# Altium project RF Board with STM32.PrjPcb
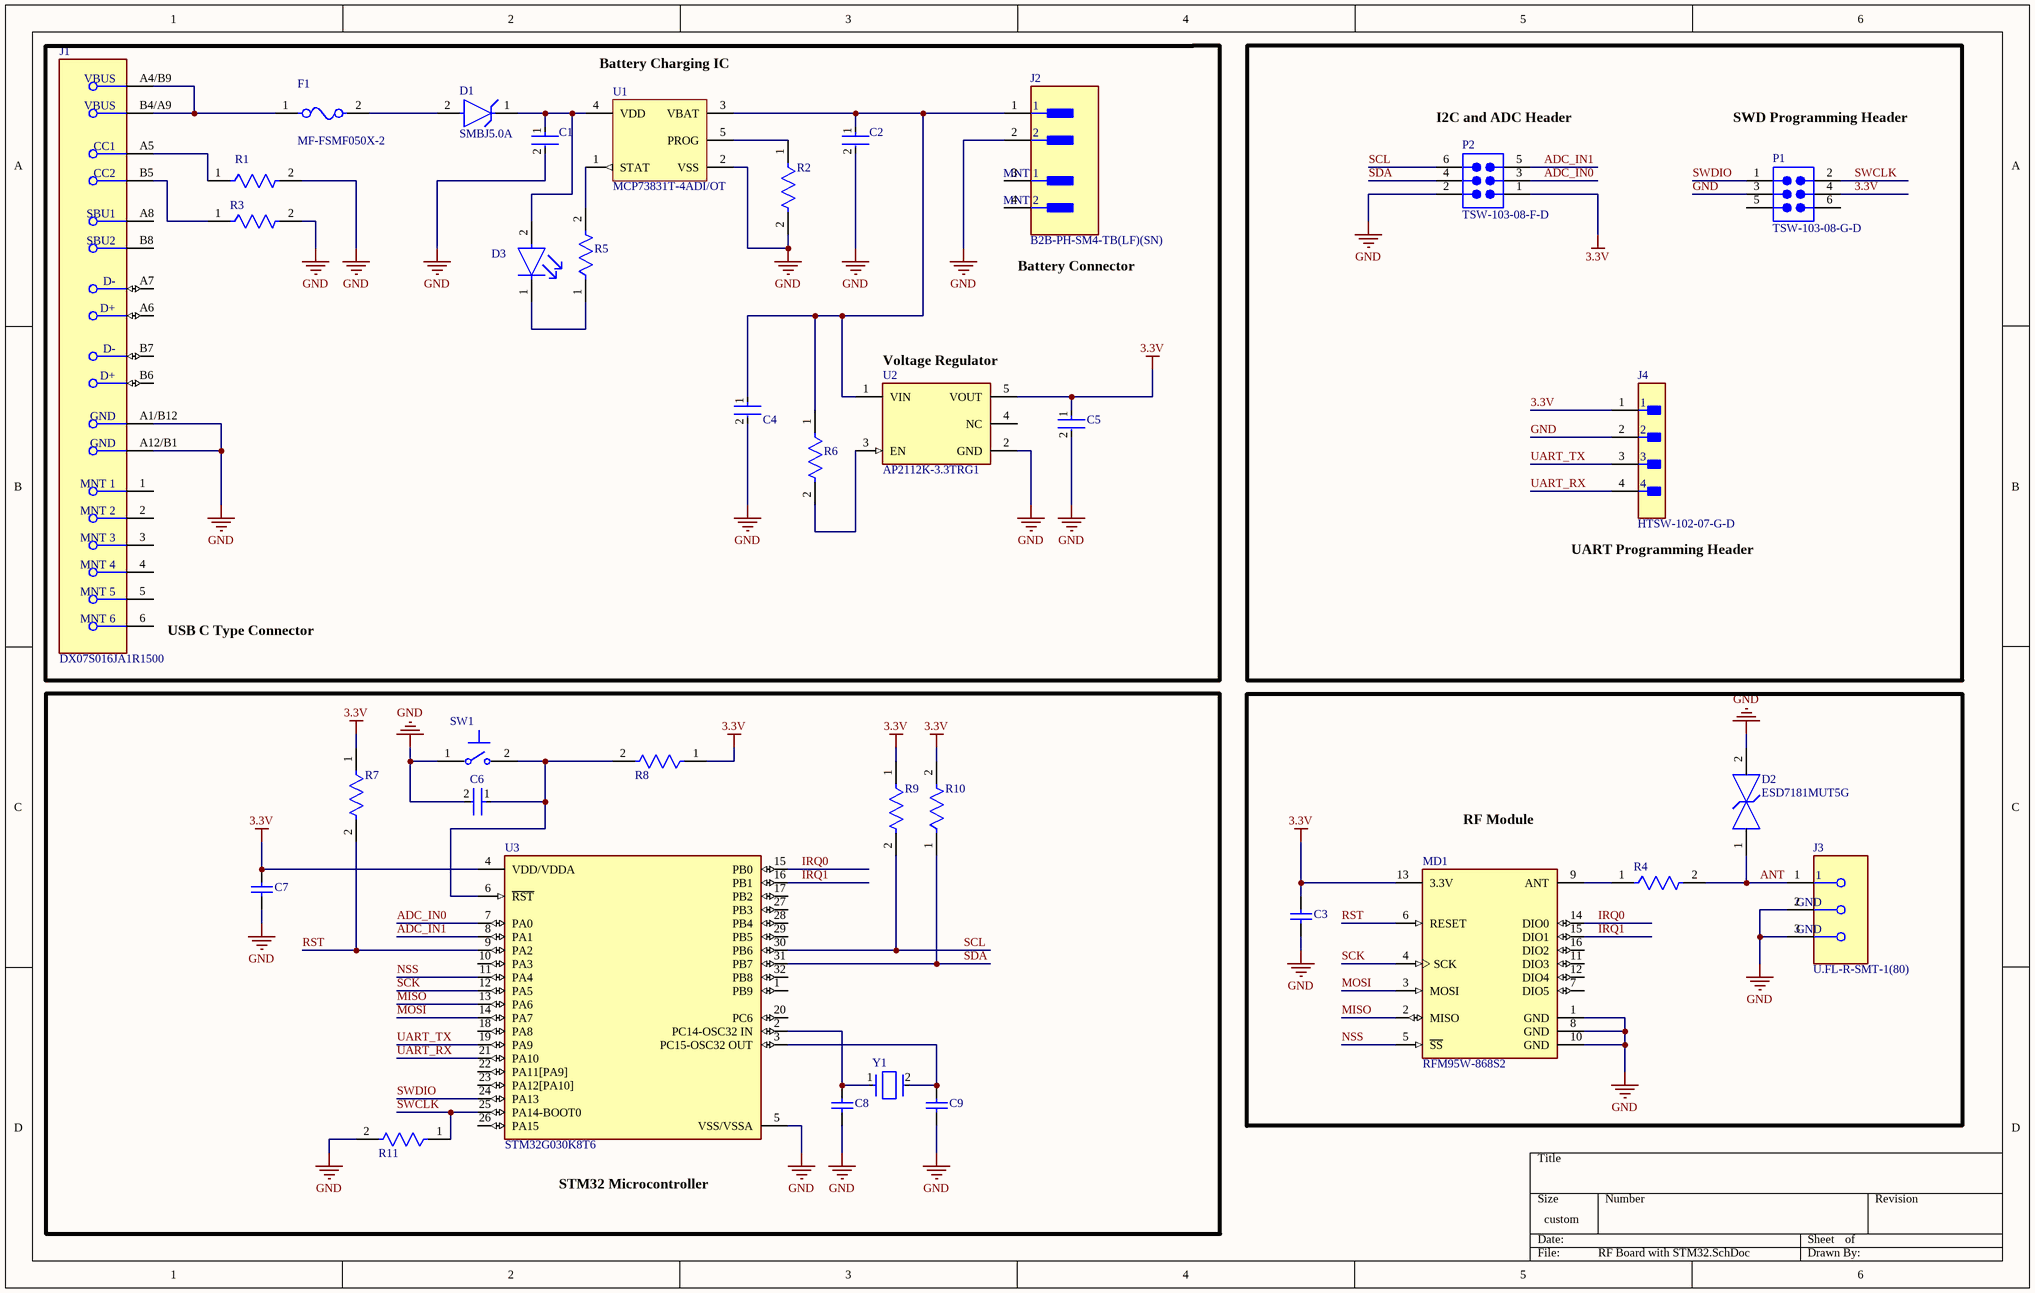
[diagram p0: RF Board with STM32.SchDoc]
1 sheet, 36 parts. Net scope: global (net labels, ports and power ports of the same name join across sheets).
Board file: RF Board with STM32..PcbDoc

## Sheet RF Board with STM32.SchDoc
size 381 x 241 mm; SheetNumber: 1; SheetTotal: 1

### Parts
C1  GRM188R61E475KE11J  [FP-GRM188-0_15-IPC_A]  (value not drawn)
C2  GRM188R61E475KE11J  [FP-GRM188-0_15-IPC_A]  (value not drawn)
C3  06031A100CAT2A  [CAPC1608X90X35ML15T15]  (value not drawn)
C4  GRM155C81A105KA12J  [FP-GRM155-0_05-IPC_A]  (value not drawn)
C5  GRM155C81A105KA12J  [FP-GRM155-0_05-IPC_A]  (value not drawn)
C6  GRM033R61A104KE15D  [FP-GRM033-0_03-IPC_C]  (value not drawn)
C7  06031A100CAT2A  [CAPC1608X90X35ML15T15]  (value not drawn)
C8  VJ0603Y104KXJAC  [CAPC1608X92X38NL15T08]  (value not drawn)
C9  VJ0603Y104KXJAC  [CAPC1608X92X38NL15T08]  (value not drawn)
D1  SMBJ5.0A  [FP-SMBJ-MFG]
D2  ESD7181MUT5G  [FP-152AF-MFG]
D3  LS R976-NR-1  [FP-LS_R976-MFG]  (value not drawn)
F1  MF-FSMF050X-2  [FP-MF-FSMF-MFG]
J1  DX07S016JA1R1500  [FP-DX07S016JA1R1500-MFG]
J2  B2B-PH-SM4-TB(LF)(SN)  [FP-B2B-PH-SM4-TB_LF_SN-MFG]
J3  U.FL-R-SMT-1(80)  [FP-U_FL-R-SMT-1_80-MFG]
J4  HTSW-102-07-G-D  [FP-HTSW-102-07-G-D-MFG]
MD1  RFM95W-868S2  [FP-RFM95W-868S2-MFG]
P1  TSW-103-08-G-D  [SMTC-TSW-103-08-X-D]
P2  TSW-103-08-F-D  [SMTC-TSW-103-08-X-D]
R1  AC0603FR-075K1L  [FP-AC0603-MFG]  (value not drawn)
R2  RP73PF1J2K0BTDF  [FP-RP73P-1J-MFG]  (value not drawn)
R3  AC0603FR-075K1L  [FP-AC0603-MFG]  (value not drawn)
R4  CRG0603ZR  [FP-CRG0603-IPC_C]  (value not drawn)
R5  RT0603BRD07470RL  [FP-RT0603-MFG]  (value not drawn)
R6  ERJ-U02F1003X  [FP-ERJU02-MFG]  (value not drawn)
R7  RT0603FRE1010KL  [FP-RT0603-MFG]  (value not drawn)
R8  RT0603FRE1010KL  [FP-RT0603-MFG]  (value not drawn)
R9  CRG0402F4K7  [FP-CRG0402-IPC_B]  (value not drawn)
R10  CRG0402F4K7  [FP-CRG0402-IPC_B]  (value not drawn)
R11  RT0603FRE1010KL  [FP-RT0603-MFG]  (value not drawn)
SW1  TL1015AF160QG  [FP-TL1015AF160QG-MFG]  (value not drawn)
U1  MCP73831T-4ADI/OT  [SOT-23-OT5_N]
U2  AP2112K-3.3TRG1  [FP-SOT25-IPC_A]
U3  STM32G030K8T6  [FP-LQFP32-5V-IPC_A]
Y1  ABS07-32.768KHZ-7-T  [FP-ABS07-MFG]  (value not drawn)

### Blocks framed on the sheet
STM32 Microcontroller: C6-C9 R7-R11 SW1 U3 Y1
RF Module: C3 D2 J3 MD1 R4

### Nets
3.3V: C3.2 C5.1 C7.2 J4.1 MD1.13(3.3V) P1.4 P2.1 R7.1 R8.1 R9.1 R10.2 U2.5(VOUT) U3.4(VDD/VDDA)
GND: C1.2 C2.2 C3.1 C4.2 C5.2 C6.2 C7.1 C8.1 C9.1 D2.2 J1.A1/B12(GND) J1.A12/B1(GND) J2.2 J3.2(GND) J3.3(GND) J4.2 MD1.1(GND) MD1.8(GND) MD1.10(GND) P1.3 P2.2 R1.2 R2.2 R3.2 R11.2 SW1.1 U1.2(VSS) U2.2(GND) U3.5(VSS/VSSA)
ADC_IN0: P2.3 U3.7(PA0)
ADC_IN1: P2.5 U3.8(PA1)
ANT: D2.1 J3.1 R4.2
IRQ0: MD1.14(DIO0) U3.15(PB0)
IRQ1: MD1.15(DIO1) U3.16(PB1)
MISO: MD1.2(MISO) U3.13(PA6)
MOSI: MD1.3(MOSI) U3.14(PA7)
NSS: MD1.5(~{SS}) U3.11(PA4)
RST: MD1.6(RESET) R7.2 U3.9(PA2)
SCK: MD1.4(SCK) U3.12(PA5)
SCL: P2.6 R9.2 U3.30(PB6)
SDA: P2.4 R10.1 U3.31(PB7)
SWCLK: P1.2 R11.1 U3.25(PA14-BOOT0)
SWDIO: P1.1 U3.24(PA13)
UART_RX: J4.4 U3.21(PA10)
UART_TX: J4.3 U3.19(PA9)
NetC1_1: C1.1 D1.1(C) D3.2(A) U1.4(VDD)
NetC2_1: C2.1 C4.1 J2.1 R6.1 U1.3(VBAT) U2.1(VIN)
NetC6_1: C6.1 R8.2 SW1.2 U3.6(~{RST})
NetC8_2: C8.2 U3.2(PC14-OSC32_IN) Y1.1
NetC9_2: C9.2 U3.3(PC15-OSC32_OUT) Y1.2
NetD1_2: D1.2(A) F1.2
NetD3_1: D3.1(C) R5.1
NetF1_1: F1.1 J1.A4/B9(VBUS) J1.B4/A9(VBUS)
NetJ1_A5: J1.A5(CC1) R1.1
NetJ1_B5: J1.B5(CC2) R3.1
NetMD1_9: MD1.9(ANT) R4.1
NetR2_1: R2.1 U1.5(PROG)
NetR5_2: R5.2 U1.1(STAT)
NetR6_2: R6.2 U2.3(EN)

Not connected (* = marked no-connect by the designer): J1 1(MNT_1) 2(MNT_2) 3(MNT_3) 4(MNT_4) 5(MNT_5) 6(MNT_6) A6(D+) A7(D-) A8(SBU1) B6(D+) B7(D-) B8(SBU2); J2 3(MNT_1) 4(MNT_2); MD1 7(DIO5) 11(DIO3) 12(DIO4) 16(DIO2); P1 5 6; U2 4(NC); U3 1(PB9) 10(PA3) 17(PB2) 18(PA8) 20(PC6) 22(PA11[PA9]) 23(PA12[PA10]) 26(PA15) 27(PB3) 28(PB4) 29(PB5) 32(PB8)

### Notes on the sheet
- (near U1) Battery Charging IC
- (near P2) I2C and ADC Header
- SWD Programming Header
- (near J2) Battery Connector
- (near U2) Voltage Regulator
- (near J4) UART Programming Header
- (near J1) USB C Type Connector

### Library data of the parts
C1 C2 = CMP-06035-051692-1: Chip Multilayer Ceramic Capacitors for General Purpose, 0603, 4.7uF, X5R, 15%, 10%, 25V; Max Operating Temperature: 85°C; Tolerance: 10%; Capacitance: 4.7uF; Weight: 0.000222oz; Voltage Rating (DC): 25V; Length: 0.063inch; Mount: Surface Mount; Packaging: Tape and Reel; Min Operating Temperature: -55°C; Package Quantity: 10000; Dielectric: X5R; Width: 0.031inch; Voltage Rating: 25V; Thickness: 0.037inch; Case/Package: 0603
C3 C7 = CMP-2006-03979-1: Manufacturer: AVX Interconnect / Elco; Part Number: 06031A100CAT2A
C4 C5 = CMP-06035-052171-1: Chip Multilayer Ceramic Capacitors for General Purpose, 0402, 1.0uF, X6S, 22%, 10%, 10V; Capacitance: 1uF; Voltage Rating: 10V; Case/Package: 0402; Voltage Rating (DC): 10V; Package Quantity: 50000; Width: 0.02inch; Length: 0.039inch; Weight: 0.000212oz; Dielectric: X6S; Tolerance: 10%; Mount: Surface Mount; Max Operating Temperature: 105°C; Thickness: 0.022inch; Packaging: Tape and Reel; Min Operating Temperature: -55°C
C6 = CMP-2010-01264-2: Chip Multilayer Ceramic Capacitors for General Purpose, 0201, 0.10uF, X5R, 15%, 10%, 10V; Capacitance: 100nF; Mount: Surface Mount; Dielectric: X5R; Width: 0.012inch; Tolerance: 10%; Radiation Hardening: No; Voltage Rating: 10V; REACH SVHC: No SVHC; Height: 0.3mm; Max Operating Temperature: 85°C; Voltage Rating (DC): 10V; Thickness: 0.013inch; Termination: SMD/SMT; Lead Free: Lead Free; Package Quantity: 1; Case/Package: 0201; Min Operating Temperature: -55°C; Weight: 6E-06oz; Length: 0.6mm; Case Code (Imperial): 0201; Depth: 0.3mm; Voltage: 10V; Packaging: Tape and Reel; Case Code (Metric): 0603
C8 C9 = CMP-2006-01976-1: Manufacturer: Vitramon; Part Number: VJ0603Y104KXJAC
D1 = CMP-07401-000003-1: TVS DIODE 5V 9.2V SMB; Manufacturer: Bourns Inc.; Number Of Channels: 1; Breakdown Voltage: 6.4V; Peak Pulse Power: 600W; Peak Pulse Current: 65.3A; Max Junction Temp: +150°C; Standoff Height: 0.05mm; Direction: Unidirectional; RoHS: TRUE; Device Class L3: unset; Height: 2.44mm; Package: SMBJ; Lead Free: Yes; Category: Diode; Device Class L1: Circuit Protection; Octopart: https://octopart.com/smbj5.0a-bourns-12809487; Reverse Standoff Voltage: 5V; Device Class L2: TVS Diodes; Temperature Range Low: -55°C; Automotive: No; Clamping Voltage: 9.2V; ComponentLink2URL: https://www.bourns.com/docs/Product-Datasheets/SMBJ.pdf; Manufacturer Part Number: SMBJ5.0A; ComponentLink2Description: Datasheet; Temperature Range High: +150°C; Digikey Description: TVS DIODE 5V 9.2V SMB; Temperature: -55°C to +150°C; Mouser Description: Dio Tvs Vwm 5.0V 600W Unidir Smb Rohs Compliant: Yes
D2 = CMP-00278-33922270-1: ESD7181MUT5G ESD Suppressor Diode TVS Bi-Dir 18.5V 2-Pin X3-DFN T/R / TVS DIODE 18.5VWM 35VC; Manufacturer Lifecycle Status: ACTIVE; Power Line Protection: No; Direction: Bidirectional; Peak Pulse Current: 1A; Capacitance: 600fF; Number of Bidirectional Channels: 1; Clamping Voltage: 35V; Element Configuration: Single; Min Breakdown Voltage: 20.5V; Packaging: Tape & Reel (TR); Lead Free: Lead Free; Reverse Standoff Voltage: 18.5V; Operating Supply Voltage: 18.5V; Number of Pins: 2; Case/Package: DFN; Working Voltage: 18.5V; Schedule B: 8536300000; Mount: Surface Mount; NexarPartId: 33922270; Lifecycle Status: Production; Max Operating Temperature: 150°C; Composition: Zener; Min Operating Temperature: -55°C; RoHS: Compliant; Contact Plating: Gold
D3 = CMP-62016-000037-1: LED RED DIFFUSED 0805 SMD; Lens Size: 1.25mm; Number of LEDs: 1; Luminous Intensity: 180mcd; Dominant Wavelength: 633nm; Lens Style: Flat; Reverse Voltage: 12V; Lens Color: White; Forward Voltage: 2.5V; Forward Current: 25mA; Power Dissipation: 65W; Luminous Flux: 0.47lm; Test Current: 20mA; Viewing Angle: 160°; Length: 2mm; Number of Pins: 2; Lens Transparency: Diffused; Min Operating Temperature: -30°C; Case Code (Metric): 2012; Depth: 1.35mm; Color: Red; Illumination Color: Red; Max Operating Temperature: 85°C; Mount: Surface Mount; Case/Package: 0805; Height: 0.9mm; Package Quantity: 16000; Number of Elements: 1; Radiation Hardening: No; Case Code (Imperial): 0805; Packaging: Tape and Reel; Width: 1.25mm
F1 = CMP-07400-000010-1: PTC RESET FUSE 6V 500MA 0603; Manufacturer: Bourns Inc.; Trip Current: 1A; Current Rating: 40A; Hold Current: 0.5A; Resistance: 0.1-0.8Ω; Value: 0.1-0.8Ω; Trip Time: 0.1s; Mouser Description: Resettable Fuses - PPTC 6volts 40amps; Category: Fuse; Digikey Description: PTC RESET FUSE 6V 500MA 0603; Temperature: -40°C to +85°C; Device Class L3: unset; Automotive: No; RoHS: TRUE; Ambient Temperature Range High: +85°C; Device Class L2: PTC Resettable Fuses; Temperature Range High: +85°C; Voltage Rating: 6V; Package: MF-FSMF; Manufacturer Part Number: MF-FSMF050X-2; Ambient Temperature Range Low: -40°C; Lead Free: Yes; ComponentLink2Description: Datasheet; Octopart: https://octopart.com/mf-fsmf050x-2-bourns-10470804; ComponentLink2URL: https://www.bourns.com/docs/Product-Datasheets/mffsmf.pdf; Temperature Range Low: -40°C; Height: 1mm; Device Class L1: Circuit Protection
J1 = CMP-19038-000003-1: CONN RCP USB2.0 TYP C 24P SMD RA
J2 = CMP-2000-05163-2: CONN HEADER SMD 2POS 2MM; Number of Poles: 2; Max Current Rating: 2A; Gender: Male; Working Voltage: 100V; Mated Stacking Heights: 8.6mm; Contact Resistance: 20mR; Insulation Resistance: 1GR; Number of Contacts: 2; Housing Material: Polyamide; Lead Pitch: 2mm; Packaging: Tape and Reel; Fastening Type: Detent; Contact Finish - Mating: TIN; Width: 5.5mm; Min Operating Temperature: -25°C; Mount: Surface Mount; Current Rating: 2A; Pitch: 2mm; REACH SVHC: No SVHC; Flammability Rating: UL94 V-0; Contact Plating: Tin; Voltage Rating (AC): 100V; Length: 7.95mm; Number of Rows: 1; Max Operating Temperature: 85°C; Connector Type: Header; Height: 9.4mm; Insulation Material: Nylon; Depth: 5mm; Color: White; Termination: Solder; Housing Color: Beige; Contact Mating Length: 0.13inch; Contact Material: Copper Alloy; Orientation: Straight; Contact Type: Male Pin; Lead Free: Lead Free; Voltage Rating: 100V; Series: PH; Number of Positions: 2; Contact Shape: Square; Max Voltage Rating (AC): 100V; Insulation Color: Natural
J3 = CMP-11598-000004-1: CONN U.FL RCPT STR 50 OHM SMD; Mating Cycles: 30; Impedance: 50R; Body Plating: Silver; Center Contact Plating: Gold; Body Material: Bronze; Dielectric Material: Polymer; Connector Type: Receptacle; Number of Ports: 1; Max Frequency: 6GHz; Mount: Surface Mount; Termination: Solder; Case/Package: SMD/SMT; Min Operating Temperature: -40°C; Series: U.FL; Max Operating Temperature: 90°C; Fastening Type: SNAP-ON; RoHS Compliant: Yes; Packaging: Tape and Reel; Package Quantity: 10000; Contact Material: Brass; Housing Color: Beige; Lead Free: Lead Free
J4 = CMP-02766-000010-1: CONN HEADER VERT 4POS 2.54MM; Manufacturer: Samtec; Voltage Rating: 550V; Conn Orientation: Straight; Number Of Contacts: 4; Conn Gender: Male; Current Rating: 6.3A; Number Of Rows: 2; Category: Conn; Temperature: -55°C to +125°C; Automotive: No; Digikey Description: CONN HEADER VERT 4POS 2.54MM; ComponentLink2URL: http://suddendocs.samtec.com/catalog_english/htsw_th.pdf; Device Class L2: Headers and Wire Housings; Mouser Description: Conn Unshrouded Header HDR 4 POS 2.54mm Solder ST Thru-Hole Bag; Manufacturer Part Number: HTSW-102-07-G-D; Temperature Range High: +125°C; Contact Material: Gold,Nickel; Temperature Range Low: -55°C; ComponentLink2Description: Datasheet; Device Class L1: Connectors; Pitch: 2.54mm; Octopart: https://octopart.com/htsw-102-07-g-d-samtec-10531767; RoHS: TRUE; Package: HTSW-102-07-G-D; Lead Free: Yes; Device Class L3: unset; Height: 8.71mm
MD1 = CMP-204316-000001-1: RX TXRX MODULE ISM < 1GHZ SMD; Data Rate: 300Kbps; Frequency: 868MHz; Sensitivity: -123dBm; Interface: SPI; Current - Transmitting: 120mA; Current - Receiving: 12.1mA; Max Operating Temperature: 70°C; Case/Package: SMD/SMT; Packaging: Bulk; Mount: Surface Mount; Min Operating Temperature: -20°C
P1 = CMP-1024-00338-1: 0.025" SQ Post Header, Through-hole, Vertical, -55 to 125 degC, 2.54 mm Pitch, 6-Pin, Male, RoHS; Manufacturer: Samtec; Pitch: 2.54 mm; ComponentLink1URL: http://www.samtec.com; ComponentLink2URL: http://www.samtec.com/documents/webfiles/pdf/TSW_TH.PDF; Temperature Range: -55 to 125 degC; RoHS: True; ComponentLink2Description: Datasheet; PackageReference: TSW-103-08-X-D; ComponentLink3Description: Package Specification; PackageDescription: .025[0.64] SQ. Post Terminal Strip Assembly; DatasheetVersion: F-214; Mounting Technology: Through-hole; ComponentLink1Description: Manufacturer URL; Orientation: Vertical; PartNumber: TSW-103-08-G-D; PackageVersion: DM, 8/1988; ComponentLink3URL: http://www.samtec.com/documents/webfiles/cpdf/TSW-XXX-XX-XXX-X-XX-XXX-MKT.pdf
P2 = CMP-1024-00337-1: 0.025" SQ Post Header, Through-hole, Vertical, -55 to 125 degC, 2.54 mm Pitch, 6-Pin, Male, RoHS; Manufacturer: Samtec; Pitch: 2.54 mm; ComponentLink1URL: http://www.samtec.com; PackageReference: TSW-103-08-X-D; ComponentLink3Description: Package Specification; PackageDescription: .025[0.64] SQ. Post Terminal Strip Assembly; PartNumber: TSW-103-08-F-D; DatasheetVersion: F-214; ComponentLink1Description: Manufacturer URL; ComponentLink2Description: Datasheet; ComponentLink2URL: http://www.samtec.com/documents/webfiles/pdf/TSW_TH.PDF; PackageVersion: DM, 8/1988; Orientation: Vertical; Mounting Technology: Through-hole; RoHS: True; Temperature Range: -55 to 125 degC; ComponentLink3URL: http://www.samtec.com/documents/webfiles/cpdf/TSW-XXX-XX-XXX-X-XX-XXX-MKT.pdf
R1 R3 = CMP-03412-025080-2: RES 5.1KΩ 1.00% 0.1W 0603; Voltage Rating: 50V; Temperature Coefficient: 100ppm/°C; Resistance: 5.1kR; Max Power Dissipation: 100mW; Tolerance: 1%; Max Operating Temperature: 155°C; Min Operating Temperature: -55°C; Ratings: AEC-Q200; Features: Moisture Resistant; RoHS Compliant: Yes; Number of Terminations: 2; Weight: 7.1E-05oz; Case Code (Imperial): 0603; Resistor Type: Thick Film; Length: 1.6mm; Termination: SMD/SMT; Case Code (Metric): 1608; Packaging: Tape and Reel; Width: 0.8mm; Series: AC; Case/Package: 0603; Power Rating: 100mW; Height: 0.45mm
R2 = CMP-03211-004349-1: RES SMD 2K OHM 0.1% 1/6W 0603; Manufacturer: TE Connectivity; Value: 2KΩ; Voltage Rating: 100V; Temperature Coefficient: 25ppm/°C; Tolerance: 0.001; Power Rating: 0.166W; Height: 0.55mm; Manufacturer Part Number: RP73PF1J2K0BTDF; Temperature: -55°C to +155°C; Category: Res; Temperature Range Low: -55°C; Ipc Land Pattern Name: RESC15580X45; Device Class L2: Resistors; Device Class L3: Chip SMD Resistors; Lead Free: Yes; ComponentLink2URL: https://www.te.com/commerce/DocumentDelivery/DDEController?Action=srchrtrv&DocNm=1773272&DocType=DS&DocLang=English; ComponentLink2Description: Datasheet; Composition: Thin Film; Device Class L1: Passive Components; Automotive: No; Temperature Range High: +155°C; RoHS: TRUE; Series: RP73P; Digikey Description: RES SMD 2K OHM 0.1% 1/6W 0603; Octopart: https://octopart.com/rp73pf1j2k0btdf-te+connectivity-23826916; Resistance: 2KΩ; Package: RP73P-1J
R4 = CMP-03211-011415-1: RES SMD 0 OHM JUMPER 1/10W 0603; Voltage Rating: 50V; Resistance: 0mR; Power Rating: 100mW; Number of Resistors: 1; Tolerance: 0%; Temperature Coefficient: 100ppm/°C; Packaging: Tape and Reel; Series: CRG, Neohm; Technology: THICK FILM; Depth: 0.8mm; Width: 0.8mm; Min Operating Temperature: -55°C; Number of Terminations: 2; Length: 1.6mm; Weight: 7.1E-05oz; Resistor Type: Thick Film; Height: 0.45mm; Max Operating Temperature: 125°C; Case/Package: 0603; ELV: Compliant; Package Quantity: 5000; Radiation Hardening: No; RoHS Compliant: Yes; Termination: Solder; Case Code (Metric): 1608; Mount: Surface Mount; Case Code (Imperial): 0603; Max Power Dissipation: 100mW
R5 = CMP-2000-04460-2: RES SMD 470 OHM 0.1% 1/10W 0603; Manufacturer: Yageo; Resistance: 470Ω; Voltage Rating: 75V; Tolerance: 0.001; Temperature Coefficient: 25 ppm/°C; Power Rating: 0.1W; Value: 470Ω; ComponentLink2Description: Datasheet; Temperature Range Low: -55°C; Mouser Description: Res Thin Film 0603 470 Ohm 0.1% 1/10W ±25ppm/°C Molded SMD SMD Paper T/R; Device Class L2: Resistors; Octopart: https://octopart.com/rt0603brd07470rl-yageo-1424253; RoHS: TRUE; Lead Free: Yes; Automotive: No; Temperature Range High: +155°C; Ipc Land Pattern Name: RESC16080X45; Package: RT0603; Category: Res; Device Class L3: Chip SMD Resistors; Manufacturer Part Number: RT0603BRD07470RL; Series: RT; Device Class L1: Passive Components; Footprint Url: http://www.yageo.com/exep/pages/download/literatures/PYu-R_Mount_10.pdf; Composition: Thin Film; Digikey Description: RES SMD 470 OHM 0.1% 1/10W 0603; Temperature: -55°C to +155°C; Height: 0.55mm; ComponentLink2URL: http://www.yageo.com/documents/recent/PYu-RT_1-to-0.01_RoHS_L_9.pdf
R6 = CMP-2002-06461-2: NexarPartId: 25970999; Voltage Rating (DC): 50V; Power Rating: 100mW; Temperature Coefficient: 200ppm/°C; Tolerance: 1%; Current Rating: 1A; Resistance: 100kΩ; Schedule B: 8533210045, 8533210045; Composition: Thick Film; Case Code (Imperial): 0402; Termination: SMD/SMT; RoHS: Compliant; Width: 500µm; REACH SVHC: Unknown; Length: 1mm; Radiation Hardening: No; Mount: Surface Mount; Max Operating Temperature: 155°C; Lifecycle Status: Production; Min Operating Temperature: -55°C; Packaging: Cut Tape; Case Code (Metric): 1005; Height: 350µm; Case/Package: 0402; Voltage Rating: 50V; Weight: 793.786648µg
R7 R8 R11 = CMP-03412-024264-1: RT0603 10KΩ 0.1W 50 ppm/°C 1.00%; Manufacturer: Yageo; Voltage Rating: 75V; Tolerance: 0.01; Temperature Range High: +155°C; Composition: Thin Film; Manufacturer Part Number: RT0603FRE1010KL; Lead Free: Yes; Temperature Range Low: -55°C; Octopart: https://octopart.com/rt0603fre1010kl-yageo-26185585; ComponentLink2URL: http://www.yageo.com/documents/recent/PYu-RT_1-to-0.01_RoHS_L_9.pdf; Category: Res; Value: 10KΩ; Temperature: -55°C to +155°C; Footprint Url: http://www.yageo.com/exep/pages/download/literatures/PYu-R_Mount_10.pdf; Device Class L3: Chip SMD Resistors; RoHS: TRUE; Temperature Coefficient: 50 ppm/°C; Device Class L1: Passive Components; Device Class L2: Resistors; Power Rating: 0.1W; Automotive: No; Resistance: 10KΩ; Ipc Land Pattern Name: RESC16080X45; Height: 0.55mm; Package: RT0603; ComponentLink2Description: Datasheet; Series: RT
R9 R10 = CMP-03211-011412-1: RES SMD 4.7K OHM 1% 1/16W 0402; RoHS Compliant: Yes
SW1 = CMP-17879-000003-1: SWITCH TACTILE SPST-NO 0.05A 12V; Actuator Type: Standard; Actuator Length: 0.5mm; Contact Current Rating: 50mA; Mechanical Life: 200000Cycles; Switch Function: Off-Mom; Switch Travel: 0.2mm; Illumination Type: Non-Illuminated; Operating Force: 160gf; Actuator Material: Nylon; Electrical Life: 50000Cycles; Throw Configuration: SPST; Contact Resistance: 100mR; Orientation: Straight; Max Voltage Rating (DC): 12V; Max Operating Temperature: 70°C; Package Quantity: 1; Contact Material: Silver; Packaging: Tape and Reel; Mount: Surface Mount; Color: Beige; Termination: Gull Wing; Case/Package: SMD/SMT; Voltage Rating (DC): 12V; Contact Plating: Silver; REACH SVHC: No SVHC; Min Operating Temperature: -20°C; Current Rating: 50mA; Lead Free: Lead Free
U1 = CMP-0133-00137-1: Miniature Single-Cell, Fully Integrated Li-Ion, Li-Polymer Charge Management Controller, 4.4V, 5-Pin SOT-23, Industrial Temperature, Tape and Reel; PackageDescription: 5-Lead Plastic Small Outline Transistor (OT) [SOT-23]; DatasheetVersion: revE, Sep-2008; PackageReference: SOT-23-OT5; PackageVersion: revBB, Aug-2009; Code_IPC: SOT23-5
U2 = CMP-12756-000035-1: IC REG LINEAR 3.3V 600MA SOT25; Number of Regulators: 1; Output Type: Fixed; Polarity: Positive; Min Input Voltage: 2.5V; Max Input Voltage: 6V; Accuracy: 1.5%; Quiescent Current: 55uA; Dropout Voltage: 250mV; Min Operating Temperature: -40°C; Length: 3.1mm; Output Current: 600mA; Max Operating Temperature: 85°C; Package Quantity: 1; Output Voltage: 3.3V; Width: 1.7mm; Number of Outputs: 1; Packaging: Tape and Reel; Height: 1.3mm; Lead Free: Lead Free; Max Output Current: 600mA; Case/Package: SOT-23-5; Mount: Surface Mount; Number of Pins: 5
U3 = CMP-12105-000136-1: IC MCU 32BIT 64KB FLASH 32LQFP; RoHS Compliant: Yes
Y1 = CMP-27762-014373-1: Crystal 32.768kHz ±20ppm (Tol) 7pF FUND 70kΩ 2-Pin CSMD T/R; Insulation Resistance: 500MR; Series Resistance: 70kR; Mount: Surface Mount; Tolerance: 20ppm; Length: 3.2mm; Lead Free: Lead Free; Frequency: 32.768kHz; Frequency Tolerance: 20ppm; Frequency Stability: 20ppm; Load Capacitance: 7pF; Radiation Hardening: No; Package Quantity: 3000; Width: 1.5mm; Height: 0.9mm; Termination: SMD/SMT; Max Operating Temperature: 85°C; Number of Pins: 2; Operating Frequency: 32.768 kHz; ESR (Equivalent Series Resistance): 70kR; Packaging: Tape and Reel; Series: ABS07; Min Operating Temperature: -40°C; Depth: 1.5mm; Case/Package: CSMD